# EAGLE design optical_flow_v10 (EAGLE 5.11)
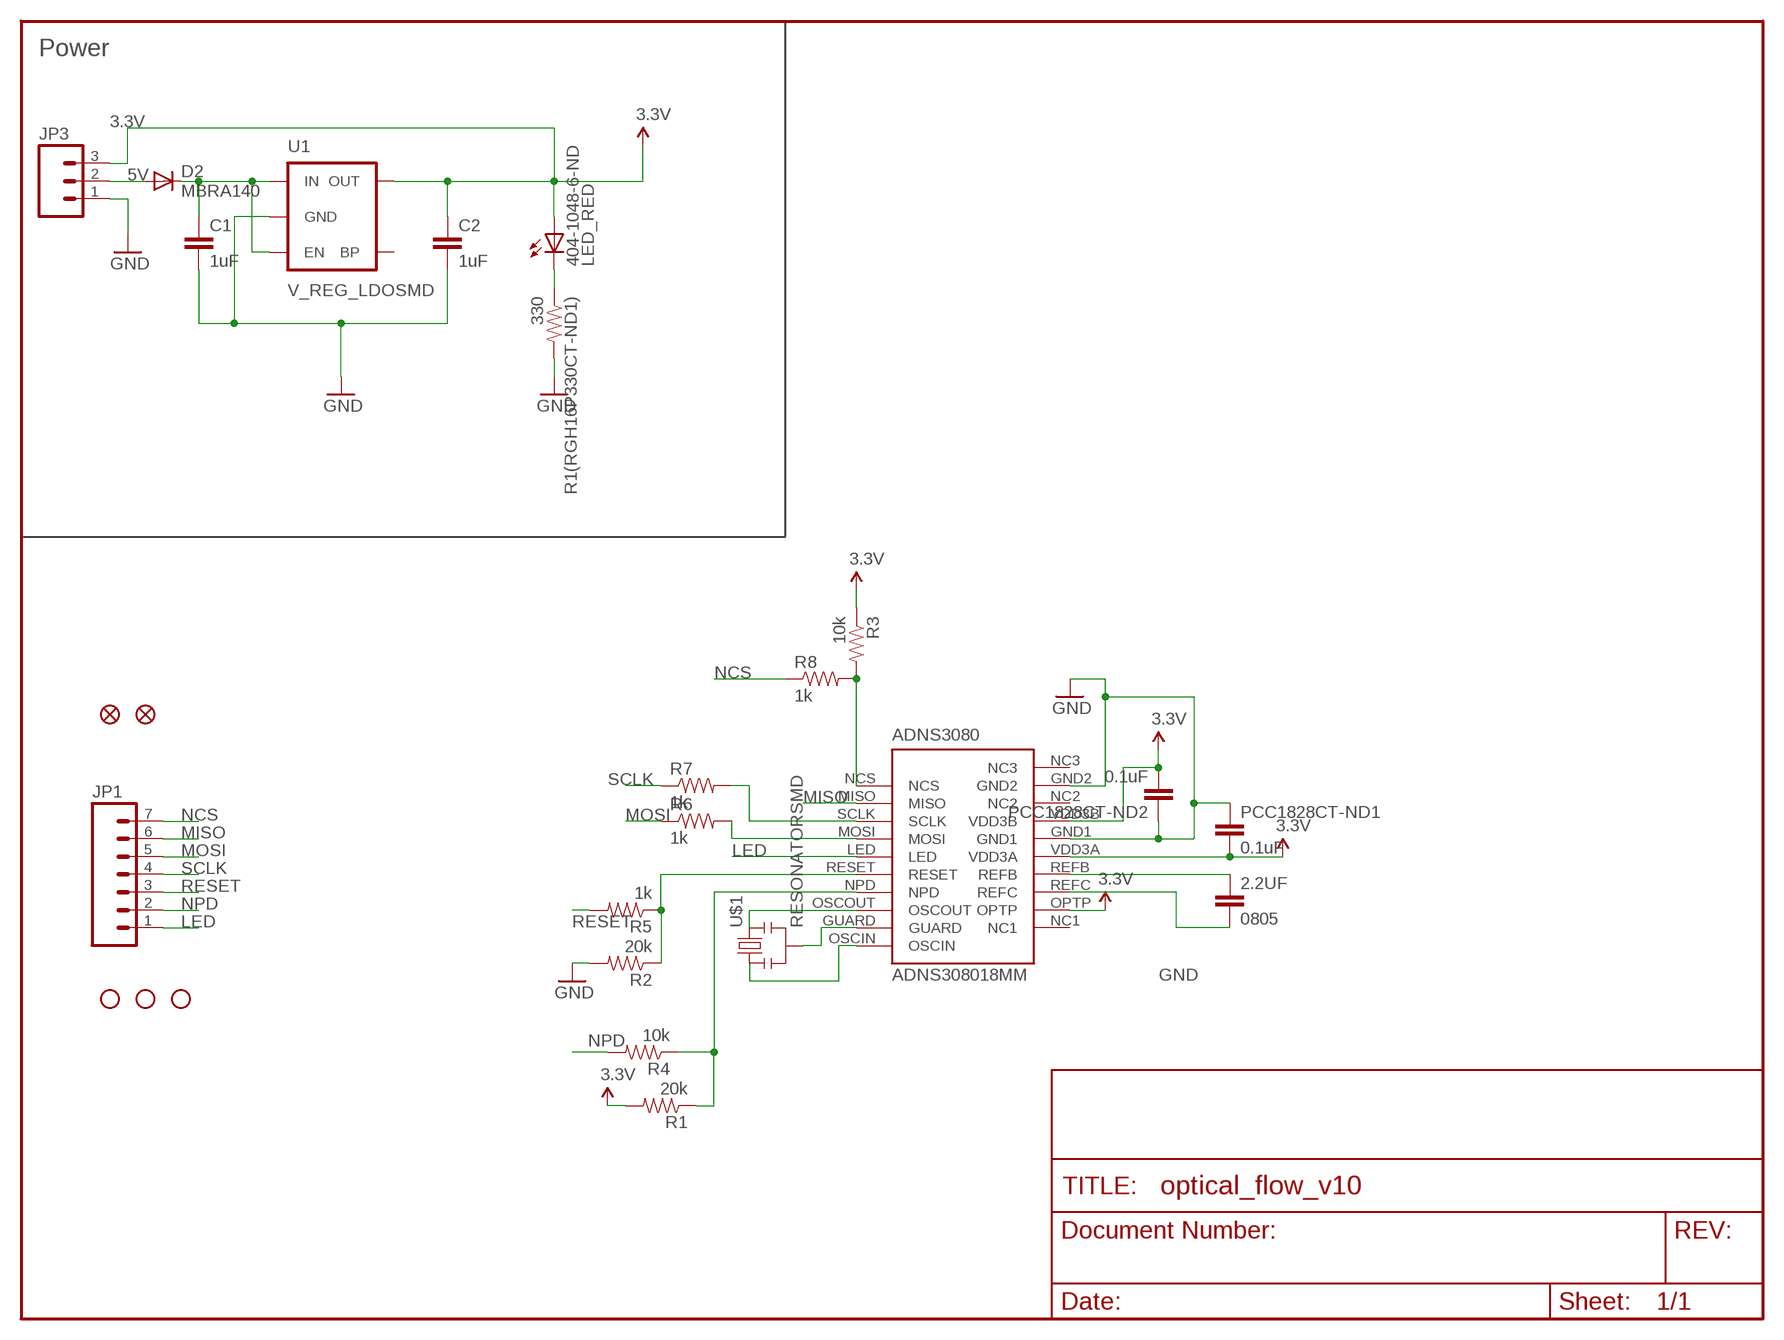
[diagram p0: schematic, sheet 1]

## Parts
2.2UF  0805  CAP0402-CAP  [0402-CAP]
404-1048-6-ND  LED_RED  LED0603  [LED-0603]
ADNS3080  ADNS308018MM  [DIL20_18MM]
C1  1uF  CAP0402-CAP  [0402-CAP]
C2  1uF  CAP0402-CAP  [0402-CAP]
D2  MBRA140  DIODESMA  [SMA-DIODE]
JP1  M07  [1X07]
JP2  FIDUCIAL1X2  [FIDUCIAL-1X2]
JP3  M03PTH  [1X03]
JP4  FIDUCIAL1X2  [FIDUCIAL-1X2]
PCC1828CT-ND1  0.1uF  CAP0402-CAP  [0402-CAP]
PCC1828CT-ND2  0.1uF  CAP0402-CAP  [0402-CAP]
R1  20k  RESISTOR0402  [C0402]
R1(RGH16P330CT-ND1)  330  RESISTOR0402  [C0402]
R2  20k  RESISTOR0402  [C0402]
R3  10k  RESISTOR0402  [C0402]
R4  10k  RESISTOR0402  [C0402]
R5  1k  RESISTOR0402  [C0402]
R6  1k  RESISTOR0402  [C0402]
R7  1k  RESISTOR0402  [C0402]
R8  1k  RESISTOR0402  [C0402]
U1  V_REG_LDOSMD  [SOT23-5]
U$1  RESONATORSMD  [RESONATOR-SMD-MYC7]
U$2  STAND-OFF  [STAND-OFF]
U$3  STAND-OFF  [STAND-OFF]
U$4  STAND-OFF  [STAND-OFF]

## Nets
3.3V: 404-1048-6-ND.A ADNS3080.OPTP ADNS3080.VDD3A ADNS3080.VDD3B C2.1 JP3.3 PCC1828CT-ND1.2 PCC1828CT-ND2.2 R1.2 R3.1 U1.5(OUT)
5V: D2.A JP3.2
GND: ADNS3080.GND1 ADNS3080.GND2 C1.2 C2.2 JP3.1 PCC1828CT-ND1.1 PCC1828CT-ND2.1 R1(RGH16P330CT-ND1).2 R2.2 U1.2(GND)
LED: ADNS3080.LED JP1.1
MISO: ADNS3080.MISO JP1.6
MOSI: JP1.5 R6.1
N$1: C1.1 D2.C U1.1(IN) U1.3(EN)
N$2: 404-1048-6-ND.C R1(RGH16P330CT-ND1).1
N$3: ADNS3080.NPD R1.1 R4.1
N$4: ADNS3080.GUARD U$1.P$2
N$6: 2.2UF.1 ADNS3080.REFB
N$7: 2.2UF.2 ADNS3080.REFC
N$8: ADNS3080.OSCOUT U$1.P$3
N$9: ADNS3080.OSCIN U$1.P$1
N$11: ADNS3080.RESET R2.1 R5.1
N$12: ADNS3080.MOSI R6.2
N$13: ADNS3080.SCLK R7.2
N$14: ADNS3080.NCS R3.2 R8.2
NCS: JP1.7 R8.1
NPD: JP1.2 R4.2
RESET: JP1.3 R5.2
SCLK: JP1.4 R7.1
Unconnected: ADNS3080.NC1 ADNS3080.NC2 ADNS3080.NC3 U1.4(BP)

## Notes on the sheet
- Power

## Library data of the parts
2.2UF C1 C2 PCC1828CT-ND1 PCC1828CT-ND2 = SparkFun:CAP: Capacitor Standard 0603 ceramic capacitor, and 0.1" leaded capacitor.
404-1048-6-ND = SparkFun:LED: LEDs Standard schematic elements and footprints for 5mm, 3mm, 1206, and 0603 sized LEDs. 5mm - Spark Fun Electronics SKU : COM-00529 (and others)
ADNS3080 = 3DRobotics:ADNS3080: Agilent ADNS3080 High-pefformance Optical Mouse Sensor The ADNS-3080 is a high performance addition to Agilent?s popular ADNS family of optical mouse sensors. The ADNS-3080 is based on a new, faster architecture with improved navigation. The sensor is capable of sensing high speed mouse motion - up to 40 inches per second and acceleration up to 15g ? for increased user precision and smoothness. The ADNS-3080 along with the ADNS-2120 (or ADNS-2120-001) lens, ADNS-2220 (or ADNS- 2220-001) assembly clip and HLMP-ED80-XX000 form a complete, compact optical mouse tracking system. There are no moving parts, which means high reliability and less maintenance for the end user. In addition, precision optical alignment is not required, facilitating high volume assembly. The sensor is programmed via registers through a four-wire serial port. It is packaged in a 20-pin staggered dual inline package (DIP).; DATASHEET: http://www.avagotech.com/docs/AV02-0366EN; LINK: http://www.avagotech.com/pages/en/navigation_interface_devices/navigation_sensors/led-based_sensors/adns-3080/; MFGPN: ADNS-3080
D2 = SparkFun:DIODE: Diode These are standard reverse protection diodes and small signal diodes. SMA package can handle up to about 1A. SOD-323 can handle about 200mA. What the SOD-323 package when ordering, there are some mfgs out there that are 5-pin packages.
JP1 = SparkFun:M07: Header 7 Standard 7-pin 0.1" header. Use with straight break away headers (SKU : PRT-00116), right angle break away headers (PRT-00553), swiss pins (PRT-00743), machine pins (PRT-00117), and female headers (PRT-00115). NOTES ON THE VARIANTS LOCK and LOCK_LONGPADS... This footprint was designed to help hold the alignment of a through-hole component (i.e. 7-pin header) while soldering it into place. You may notice that each hole has been shifted either up or down by 0.005 of an inch from it's more standard position (which is usually a perfectly straight line). This slight alteration caused the pins (the squares in the middle) to touch the edges of the holes. Because they are alternating, it causes a "brace" to hold the header in place. 0.005 has proven to be the perfect amount of "off-center" position when using our standard breakaway headers. Although looks a little odd when you look at the bare footprint, once you have a header in there, the alteration is very hard to notice. Also, if you push a header all the way into place, it is covered up entirely on the bottom side. This idea of altering the position of holes to aid alignment will be further integrated into the Sparkfun Library for other footprints. It can help hold any component with 3 or more connection pins.
JP2 JP4 = SparkFun:FIDUCIAL: Fiducial Alignment Points Various fiducial points for machine vision alignment.
JP3 = SparkFun:M03: Header 3 Standard 3-pin 0.1" header. Use with straight break away headers (SKU : PRT-00116), right angle break away headers (PRT-00553), swiss pins (PRT-00743), machine pins (PRT-00117), and female headers (PRT-00115). Molex polarized connector foot print use with SKU : PRT-08232 with associated crimp pins and housings.
R1 R1(RGH16P330CT-ND1) R2-R8 = SparkFun:RESISTOR: Resistor Basic schematic elements and footprints for 0603, 1206, and PTH 1/10th watt (small) resistors.
U1 = SparkFun:V_REG_LDO: Voltage Regulator LDO Standard 150mA LDO voltage regulator in SOT-23 layout. Micrel part MIC5205. BP (by-pass) pin is used to lower output noise with 470pF cap.
U$1 = 3DRobotics_Master_Library:RESONATOR: Ceramic Resonator TDK SMD ceramic resonator, 24 to 50MHz, built-in load capacitance. Used for the ADNS3080 optical sensor board.; DATASHEET: http://www.tdk.co.jp/tefe02/ef31_ccr.pdf; LINK: http://search.digikey.com/scripts/DkSearch/dksus.dll?Detail&name=445-5234-2-ND; MFGPN: CCR24.0MYC7B05T1
U$2-U$4 = SparkFun:STAND-OFF: Stand Off This is the mechanical footprint for a #4 phillips button head screw. Use the keepout ring to avoid running the screw head into surrounding components. SKU : PRT-00447

## Board
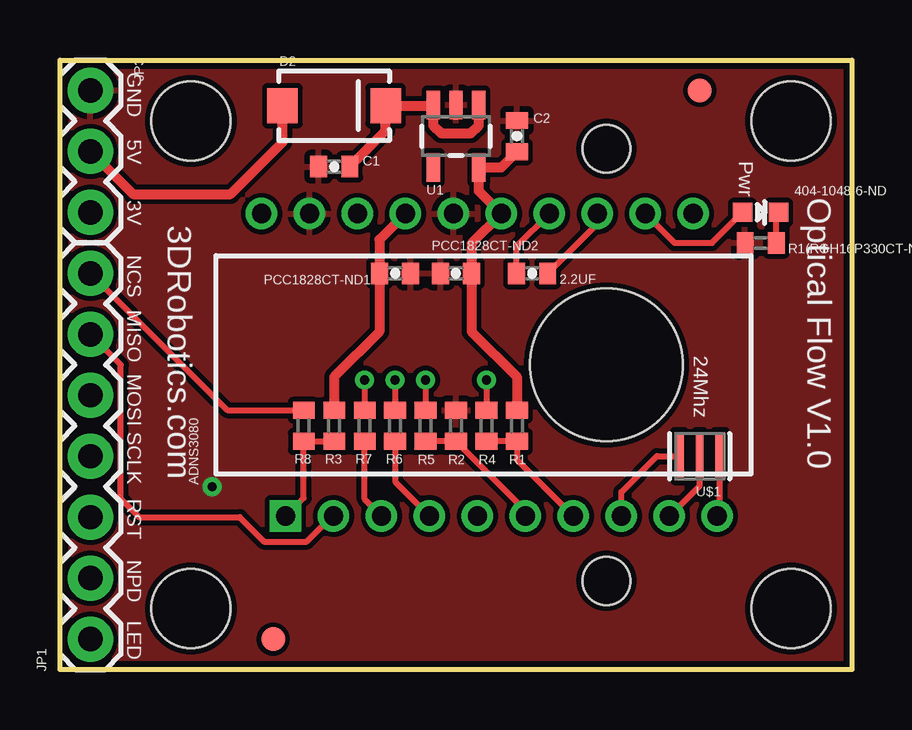
[diagram p1: board, top side]
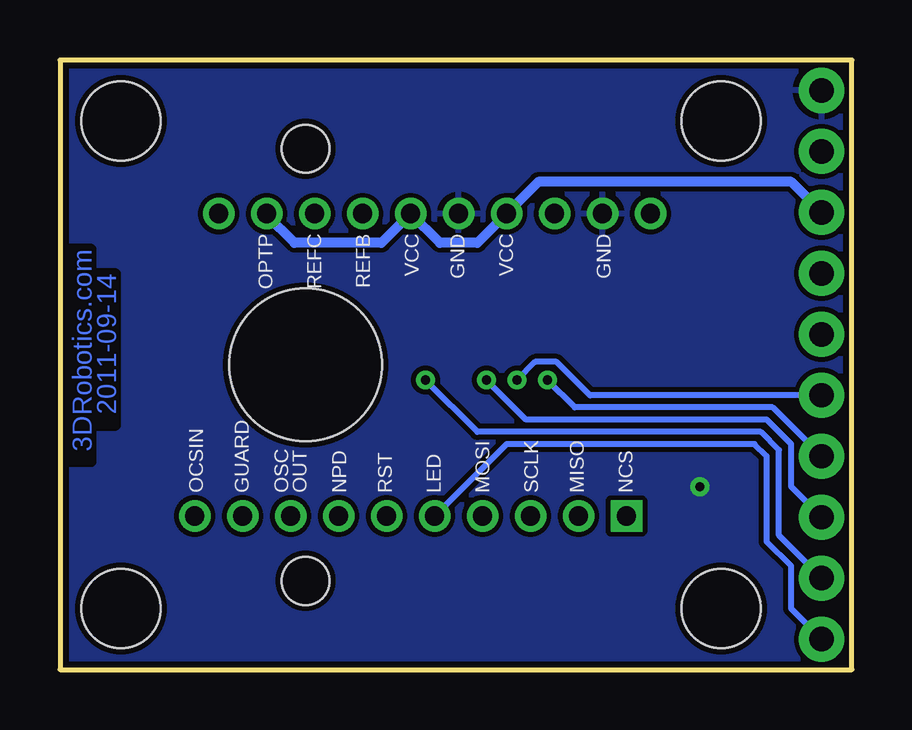
[diagram p2: board, bottom side, seen from below]

Size 33.02 x 25.4 mm. Coordinates in mm from the lower left corner, seen from the top.
Outline: 0,0 0,25.4 33.02,25.4 33.02,0 0,0
Copper layers (1*16): Top 0.035mm / dielectric 1.5mm / Bottom 0.035mm
Design rules "default *": minimum track width 10mil, minimum drill 24mil, track to track 8mil, track to pad 8mil, pad to pad 8mil, via to via 8mil, smd to smd 8mil, copper to edge 10mil, drill to drill 8mil, minimum pad ring 10mil, minimum via ring 8mil, stop-mask expansion 4mil, vias tented up to drill 0mil, thermal gap 10mil

### Footprints (pad centres in the part's own frame; a part is rotated, then mirrored left to right if it is on the bottom)
0402-CAP = smd 0.7 x 0.9: 1 -0.65,0; 2 0.65,0
LED-0603 = smd 0.8 x 0.8: A 0,-0.75; C 0,0.75
DIL20_18MM = drill 0.8 round: GND1 6.3,1.38; GND2 6.3,7.38; GUARD -6.3,-7.62; LED -6.3,0.38; MISO -6.3,6.38; MOSI -6.3,2.38; NC1 6.3,-8.62; NC2 6.3,5.38; NC3 6.3,9.38; NPD -6.3,-3.62; OPTP 6.3,-6.62; OSCIN -6.3,-9.62; OSCOUT -6.3,-5.62; REFB 6.3,-2.62; REFC 6.3,-4.62; RESET -6.3,-1.62; SCLK -6.3,4.38; VDD3A 6.3,-0.62; VDD3B 6.3,3.38 | drill 0.8 square: NCS -6.3,8.38 | hole 6.35: 0,-5 | hole 2: -9,-5; 9,-5
SMA-DIODE = smd 1.27 x 1.47: A -2.15,0; C 2.15,0
1X07 = drill 1.016 pad 1.88 round: 1 0,0; 2 2.54,0; 3 5.08,0; 4 7.62,0; 5 10.16,0; 6 12.7,0; 7 15.24,0
FIDUCIAL-1X2 = smd 1 x 1: 1 0,0
1X03 = drill 1.016 pad 1.88 round: 1 0,0; 2 2.54,0; 3 5.08,0
C0402 = smd 0.7 x 0.9: 1 -0.65,0; 2 0.65,0
SOT23-5 = smd 0.55 x 1.2: 1 -0.95,-1.3; 2 0,-1.3; 3 0.95,-1.3; 4 0.95,1.3; 5 -0.95,1.3
RESONATOR-SMD-MYC7 = smd 0.4 x 2: P$1 -0.85,0; P$3 0.85,0 | smd 0.3 x 2: P$2 0,0
STAND-OFF = hole 3.302: 0,0

### Placement (x,y rotation side)
2.2UF  19.68,16.51 0 top
404-1048-6-ND  29.21,19.05 270 top
ADNS3080  17.78,12.7 90 top
C1  11.43,20.95 180 top
C2  19.05,22.23 90 top
D2  11.43,23.5 0 top
JP1  1.27,1.27 90 top
JP2  8.89,1.27 0 top
JP3  1.27,24.13 270 top
JP4  26.67,24.13 0 top
PCC1828CT-ND1  13.97,16.51 180 top
PCC1828CT-ND2  16.51,16.51 0 top
R1  19.05,10.16 90 top
R1(RGH16P330CT-ND1)  29.21,17.78 180 top
R2  16.51,10.16 90 top
R3  11.43,10.16 270 top
R4  17.78,10.16 90 top
R5  15.24,10.16 90 top
R6  13.97,10.16 270 top
R7  12.7,10.16 270 top
R8  10.16,10.16 270 top
U1  16.51,22.23 180 top
U$1  26.67,8.89 180 top
U$2  5.46,2.54 0 top
U$3  5.46,22.86 0 top
U$4  30.48,22.86 0 top
U$5  STAND-OFF  [STAND-OFF]  30.48,2.54 0 top

### Tracks (layer width: path | path; a pad name or v marks a point on that pad's centre or on a via)
3.3V
  Top 0.254: 404-1048-6-ND.A 28.45,19.05 27.18,17.78 25.62,17.78 ADNS3080.OPTP
  Top 0.406: ADNS3080.VDD3B 13.32,17.92 PCC1828CT-ND1.2 13.32,14.08 11.43,12.19 R3.1 | C2.1 18.4,20.93 U1.5 17.46,19.94 ADNS3080.VDD3A 17.16,17.76 PCC1828CT-ND2.2 17.16,14.08 19.05,12.19 R1.2
  Bottom 0.406: ADNS3080.OPTP 24.4,18.94 23.24,17.78 19.62,17.78 ADNS3080.VDD3A 17.18,17.78 15.62,17.78 ADNS3080.VDD3B 13.08,20.32 2.54,20.32 JP3.3
5V
  Top 0.406: 9.28,23.25 D2.A 9.27,23.49 9.27,21.97 7.11,19.81 3.05,19.81 JP3.2
GND  (via drill 0.38)
  other vias: 6.35,7.62
  pour Bottom: 0,26.67 35.56,26.67 35.56,-1.27 0,-1.27
  pour Top: 0,26.67 34.29,26.67 34.29,-1.27 0,-1.27
LED
  Bottom 0.254: JP1.1 2.54,2.54 2.54,4.32 3.56,5.33 3.56,8.89 4.06,9.4 14.4,9.4 ADNS3080.LED
MISO
  Top 0.254: ADNS3080.MISO 11.35,6.4 10.29,5.33 8.51,5.33 7.49,6.35 3.3,6.35 2.54,7.11 2.54,12.7 JP1.6
MOSI  (via drill 0.38)
  Top 0.254: v13.97,12.06 R6.1
  Bottom 0.254: JP1.5 10.92,11.43 12.32,12.83 13.21,12.83 v13.97,12.06
N$1
  Top 0.406: C1.1 13.58,22.45 D2.C 15.53,23.5 U1.3 15.56,22.67 15.88,22.35 17.14,22.35 17.46,22.67 U1.1
N$2
  Top 0.254: R1(RGH16P330CT-ND1).1 29.86,18.95 404-1048-6-ND.C
N$3
  Top 0.254: R4.1 R1.1 19.05,8.75 ADNS3080.NPD
N$4
  Top 0.254: U$1.P$2 26.67,7.67 ADNS3080.GUARD
N$6
  Top 0.254: 2.2UF.1 19.04,17.64 ADNS3080.REFB
N$7
  Top 0.254: ADNS3080.REFC 22.4,18.57 2.2UF.2
N$8
  Top 0.254: ADNS3080.OSCOUT 23.4,7.4 24.89,8.89 U$1.P$3
N$9
  Top 0.254: U$1.P$1 27.52,6.52 ADNS3080.OSCIN
N$11
  Top 0.254: R5.1 R2.1 19.4,6.62 ADNS3080.RESET
N$12
  Top 0.254: R6.2 13.97,7.83 ADNS3080.MOSI
N$13
  Top 0.254: R7.2 12.7,7.1 ADNS3080.SCLK
N$14
  Top 0.254: R3.2 R8.2 10.16,7.16 ADNS3080.NCS
NCS
  Top 0.254: R8.1 6.97,10.81 JP1.7
NPD  (via drill 0.38)
  Top 0.254: v17.78,12.06 R4.2
  Bottom 0.254: JP1.2 3.05,5.59 3.05,9.14 3.81,9.91 15.62,9.91 v17.78,12.06
RESET  (via drill 0.38)
  Top 0.254: v15.24,12.06 R5.2
  Bottom 0.254: JP1.3 2.54,7.62 2.54,9.4 3.56,10.41 13.59,10.41 v15.24,12.06
SCLK  (via drill 0.38)
  Top 0.254: v12.7,12.06 R7.1
  Bottom 0.254: JP1.4 3.3,10.92 11.56,10.92 v12.7,12.06

### Text on the board
Bottom: 3DRobotics.com | 2011-09-14
tPlace: GND | 5V | Pwr | 3V | Optical Flow V1.0 | 3DRobotics.com | NCS | MISO | 24Mhz | MOSI | SCLK | RST | NPD | LED
bPlace: GND | VCC | GND | VCC | REFB | REFC | OPTP | NCS | MISO | SCLK | MOSI | LED | RST | NPD | OUT | OSC | GUARD | OCSIN